# Altium schematic sheet 继电器板.SchDoc
size A2
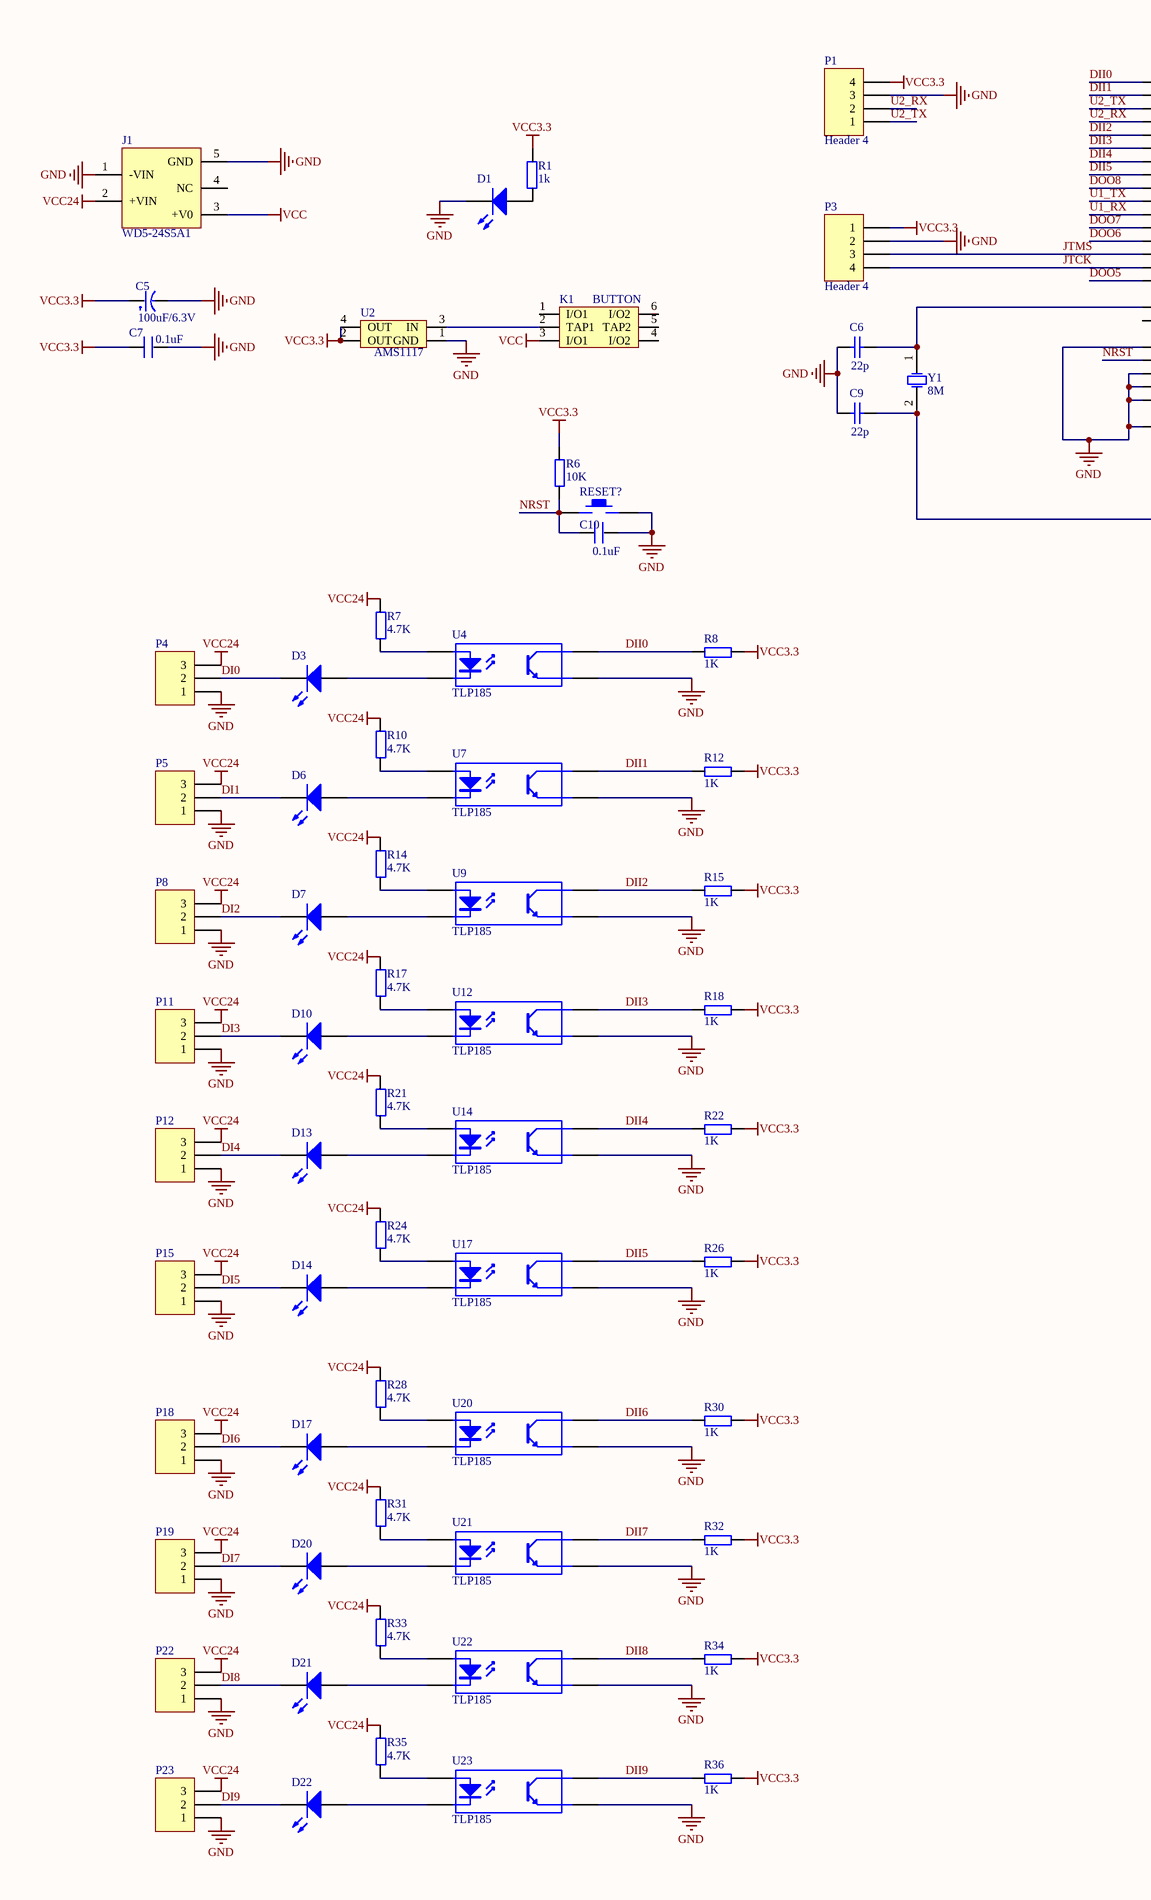
[diagram p0: 继电器板.SchDoc, left]
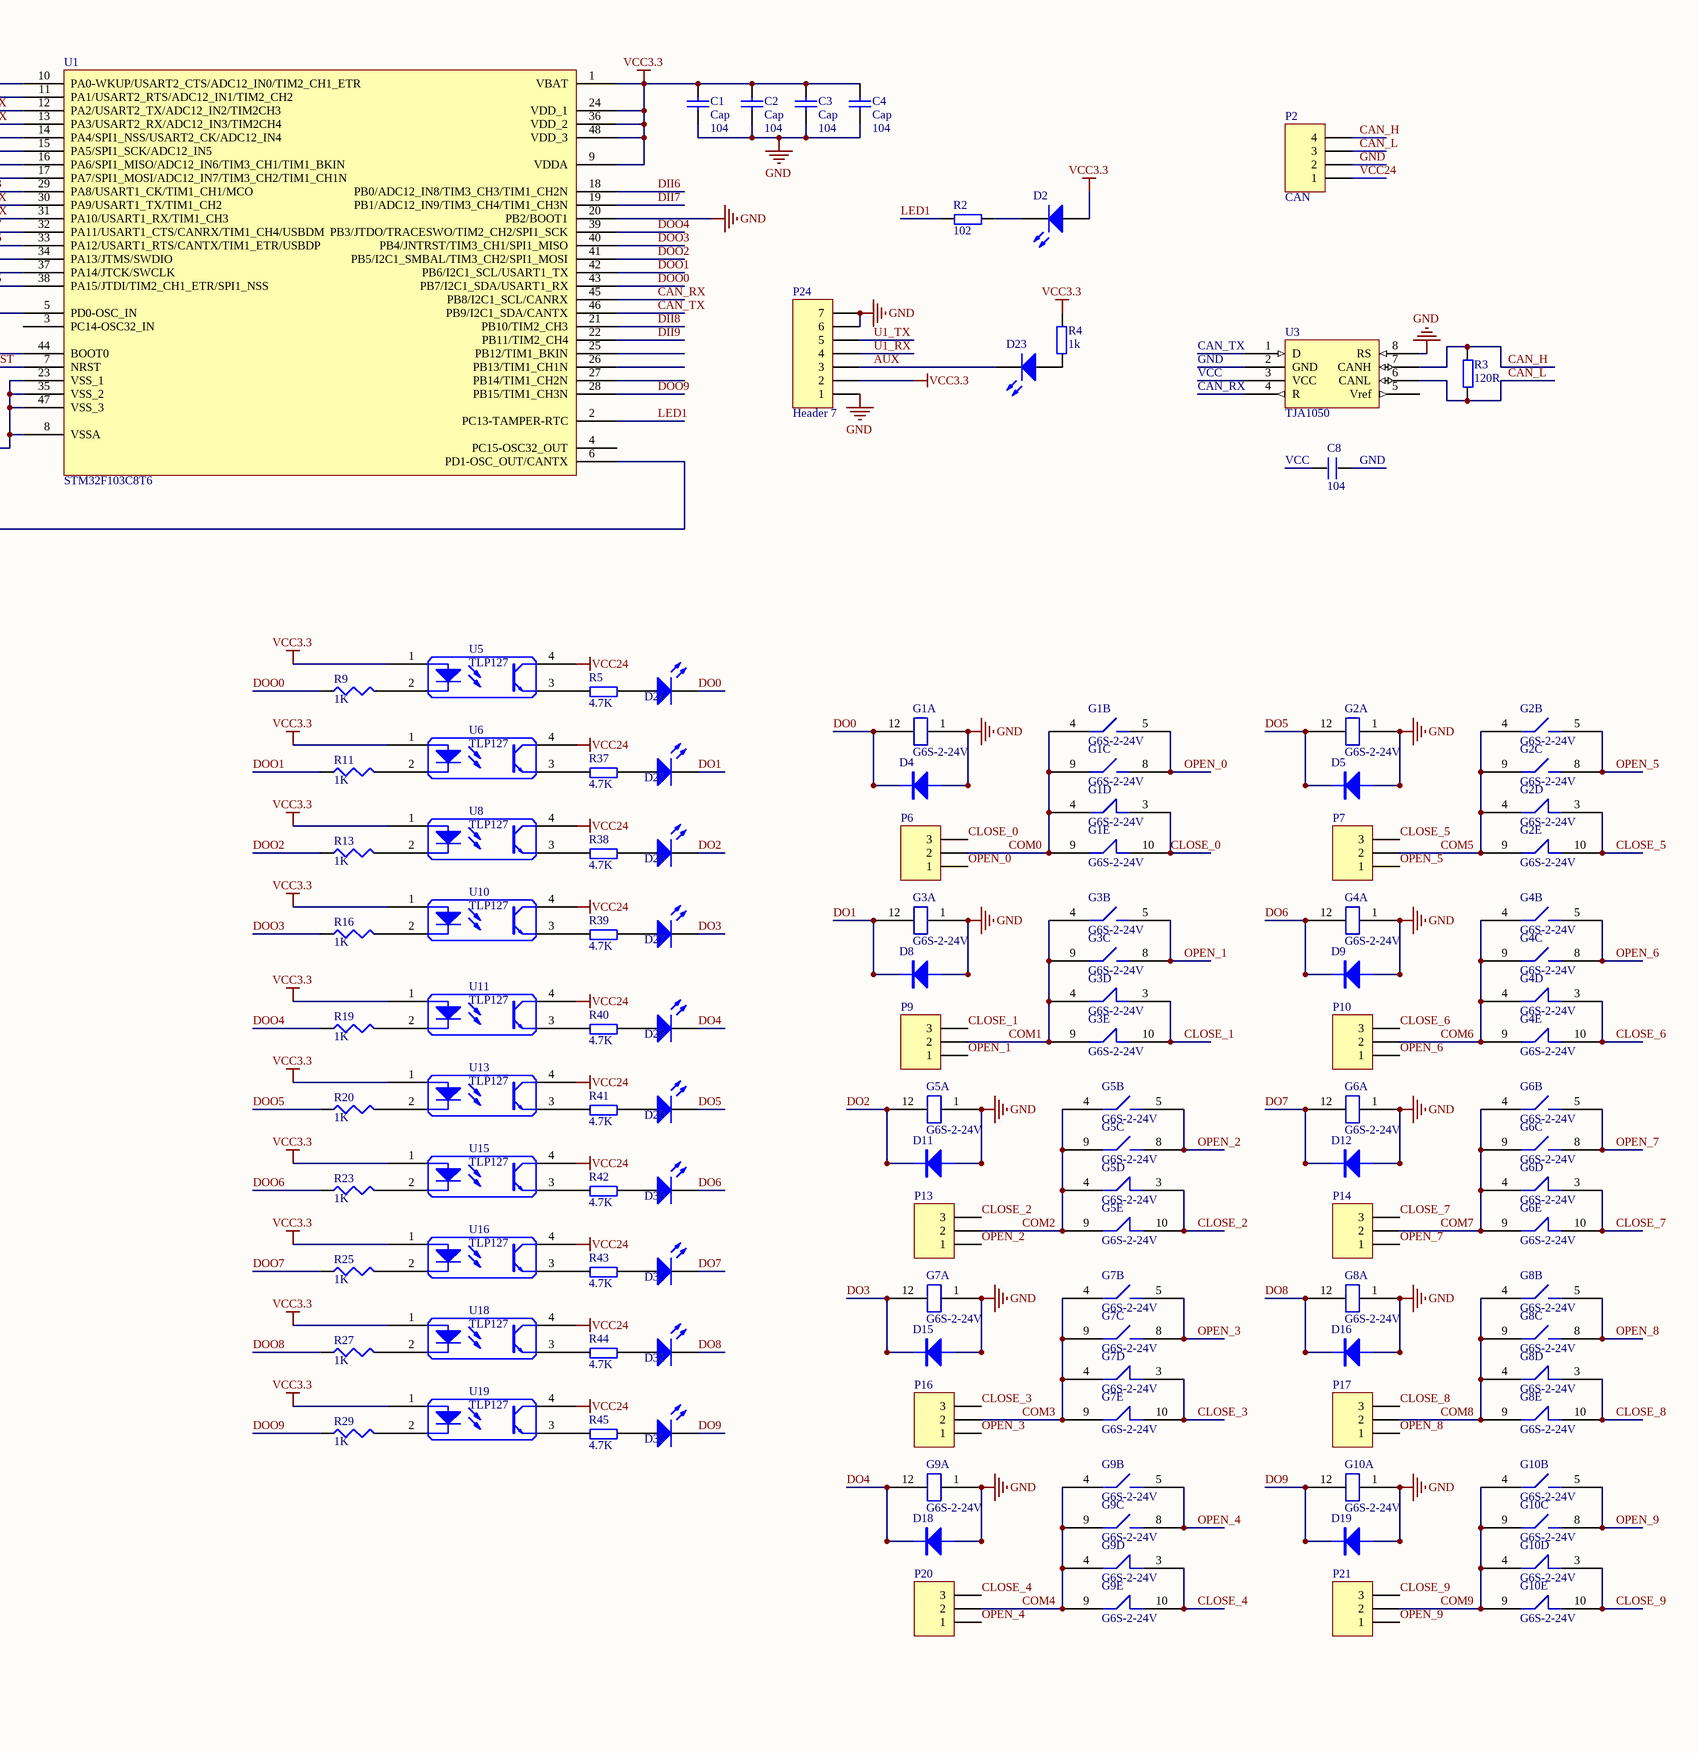
[diagram p1: 继电器板.SchDoc, right]

## Parts
C1  Cap  value 104  [C0805]
C2  Cap  value 104  [C0805]
C3  Cap  value 104  [C0805]
C4  Cap  value 104  [C0805]
C5  100uF/6.3V  [3216]
C6  value 22p  [C0805]  (hidden comment: Cap)
C7  0.1uF  [C0805]
C8  104  [C0805]
C9  value 22p  [C0805]  (hidden comment: Cap)
C10  0.1uF  [C0805]
D1  LED0  [LC-0805_LED_S1]  (value not drawn)
D2  LED0  [LC-0805_LED_S1]  (value not drawn)
D3  LED0  [LC-0805_LED_S1]  (value not drawn)
D4  (no value)  [LC-LL-34]
D5  (no value)  [LC-LL-34]
D6  LED0  [LC-0805_LED_S1]  (value not drawn)
D7  LED0  [LC-0805_LED_S1]  (value not drawn)
D8  (no value)  [LC-LL-34]
D9  (no value)  [LC-LL-34]
D10  LED0  [LC-0805_LED_S1]  (value not drawn)
D11  (no value)  [LC-LL-34]
D12  (no value)  [LC-LL-34]
D13  LED0  [LC-0805_LED_S1]  (value not drawn)
D14  LED0  [LC-0805_LED_S1]  (value not drawn)
D15  (no value)  [LC-LL-34]
D16  (no value)  [LC-LL-34]
D17  LED0  [LC-0805_LED_S1]  (value not drawn)
D18  (no value)  [LC-LL-34]
D19  (no value)  [LC-LL-34]
D20  LED0  [LC-0805_LED_S1]  (value not drawn)
D21  LED0  [LC-0805_LED_S1]  (value not drawn)
D22  LED0  [LC-0805_LED_S1]  (value not drawn)
D23  LED0  [LC-0805_LED_S1]  (value not drawn)
D24  LED0  [LC-0805_LED_S1]  (value not drawn)
D25  LED0  [LC-0805_LED_S1]  (value not drawn)
D26  LED0  [LC-0805_LED_S1]  (value not drawn)
D27  LED0  [LC-0805_LED_S1]  (value not drawn)
D28  LED0  [LC-0805_LED_S1]  (value not drawn)
D29  LED0  [LC-0805_LED_S1]  (value not drawn)
D30  LED0  [LC-0805_LED_S1]  (value not drawn)
D31  LED0  [LC-0805_LED_S1]  (value not drawn)
D32  LED0  [LC-0805_LED_S1]  (value not drawn)
D33  LED0  [LC-0805_LED_S1]  (value not drawn)
G1  G6S-2-24V  [G6S-2-24V]  (parts A,B,C,D,E of 5)
G2  G6S-2-24V  [G6S-2-24V]  (parts A,B,C,D,E of 5)
G3  G6S-2-24V  [G6S-2-24V]  (parts A,B,C,D,E of 5)
G4  G6S-2-24V  [G6S-2-24V]  (parts A,B,C,D,E of 5)
G5  G6S-2-24V  [G6S-2-24V]  (parts A,B,C,D,E of 5)
G6  G6S-2-24V  [G6S-2-24V]  (parts A,B,C,D,E of 5)
G7  G6S-2-24V  [G6S-2-24V]  (parts A,B,C,D,E of 5)
G8  G6S-2-24V  [G6S-2-24V]  (parts A,B,C,D,E of 5)
G9  G6S-2-24V  [G6S-2-24V]  (parts A,B,C,D,E of 5)
G10  G6S-2-24V  [G6S-2-24V]  (parts A,B,C,D,E of 5)
J1  WD5-24S5A1  [WD5-24S3V3]
K1  BUTTON  [BTN8.5*8.5]
P1  Header 4  [HDR1X4]
P2  CAN  [DZ-4-3.5]
P3  Header 4  [IDE4]
P4  (no value)  [DZ-3-3.5]
P5  (no value)  [DZ-3-3.5]
P6  (no value)  [DZ-3-3.5]
P7  (no value)  [DZ-3-3.5]
P8  (no value)  [DZ-3-3.5]
P9  (no value)  [DZ-3-3.5]
P10  (no value)  [DZ-3-3.5]
P11  (no value)  [DZ-3-3.5]
P12  (no value)  [DZ-3-3.5]
P13  (no value)  [DZ-3-3.5]
P14  (no value)  [DZ-3-3.5]
P15  (no value)  [DZ-3-3.5]
P16  (no value)  [DZ-3-3.5]
P17  (no value)  [DZ-3-3.5]
P18  (no value)  [DZ-3-3.5]
P19  (no value)  [DZ-3-3.5]
P20  (no value)  [DZ-3-3.5]
P21  (no value)  [DZ-3-3.5]
P22  (no value)  [DZ-3-3.5]
P23  (no value)  [DZ-3-3.5]
P24  Header 7  [AS50-T27]
R1  1k  [0805]
R2  102  [0805]
R3  120R  [0805]
R4  1k  [0805]
R5  4.7K  [0805]
R6  10K  [0805]
R7  4.7K  [0805]
R8  1K  [0805]
R9  1K  [0805]
R10  4.7K  [0805]
R11  1K  [0805]
R12  1K  [0805]
R13  1K  [0805]
R14  4.7K  [0805]
R15  1K  [0805]
R16  1K  [0805]
R17  4.7K  [0805]
R18  1K  [0805]
R19  1K  [0805]
R20  1K  [0805]
R21  4.7K  [0805]
R22  1K  [0805]
R23  1K  [0805]
R24  4.7K  [0805]
R25  1K  [0805]
R26  1K  [0805]
R27  1K  [0805]
R28  4.7K  [0805]
R29  1K  [0805]
R30  1K  [0805]
R31  4.7K  [0805]
R32  1K  [0805]
R33  4.7K  [0805]
R34  1K  [0805]
R35  4.7K  [0805]
R36  1K  [0805]
R37  4.7K  [0805]
R38  4.7K  [0805]
R39  4.7K  [0805]
R40  4.7K  [0805]
R41  4.7K  [0805]
R42  4.7K  [0805]
R43  4.7K  [0805]
R44  4.7K  [0805]
R45  4.7K  [0805]
RESET?  KEY_M  [SW_PB2_A1]  (value not drawn)
U1  STM32F103C8T6  [LC-LQFP-48]
U2  AMS1117  [LC-SOT-223]
U3  TJA1050  [SOP-8]
U4  TLP185  [TLP127]
U5  TLP127  [SO-4]
U6  TLP127  [SO-4]
U7  TLP185  [TLP127]
U8  TLP127  [SO-4]
U9  TLP185  [TLP127]
U10  TLP127  [SO-4]
U11  TLP127  [SO-4]
U12  TLP185  [TLP127]
U13  TLP127  [SO-4]
U14  TLP185  [TLP127]
U15  TLP127  [SO-4]
U16  TLP127  [SO-4]
U17  TLP185  [TLP127]
U18  TLP127  [SO-4]
U19  TLP127  [SO-4]
U20  TLP185  [TLP127]
U21  TLP185  [TLP127]
U22  TLP185  [TLP127]
U23  TLP185  [TLP127]
Y1  8M  [XTAL_US]

## Nets
GND: C1.2 C2.2 C3.2 C4.2 C5.2(GND) C6.2 C7.1 C8.2 C9.2 C10.2 D1.K D4.1(A) D5.1(A) D8.1(A) D9.1(A) D11.1(A) D12.1(A) D15.1(A) D16.1(A) D18.1(A) D19.1(A) G1.1 G2.1 G3.1 G4.1 G5.1 G6.1 G7.1 G8.1 G9.1 G10.1 J1.1(-VIN) J1.5(GND) P1.3 P2.2 P3.2 P4.1 P5.1 P8.1 P11.1 P12.1 P15.1 P18.1 P19.1 P22.1 P23.1 P24.1 P24.6 P24.7 RESET?.2 U1.8(VSSA) U1.20(PB2/BOOT1) U1.23(VSS_1) U1.35(VSS_2) U1.44(BOOT0) U1.47(VSS_3) U2.1(GND) U3.2(GND) U3.8(RS) U4.4(EMITTER) U7.4(EMITTER) U9.4(EMITTER) U12.4(EMITTER) U14.4(EMITTER) U17.4(EMITTER) U20.4(EMITTER) U21.4(EMITTER) U22.4(EMITTER) U23.4(EMITTER)
VCC: C8.1 J1.3(+V0) K1.3(I/O1) U3.3(VCC)
VCC3.3: C1.1 C2.1 C3.1 C4.1 C5.1(VCC) C7.2 D2.A P1.4 P3.1 P24.2 R1.1 R4.1 R6.2 R8.2 R12.2 R15.2 R18.2 R22.2 R26.2 R30.2 R32.2 R34.2 R36.2 U1.1(VBAT) U1.9(VDDA) U1.24(VDD_1) U1.36(VDD_2) U1.48(VDD_3) U2.2(OUT) U2.4(OUT) U5.1 U6.1 U8.1 U10.1 U11.1 U13.1 U15.1 U16.1 U18.1 U19.1
VCC24: J1.2(+VIN) P2.1 P4.3 P5.3 P8.3 P11.3 P12.3 P15.3 P18.3 P19.3 P22.3 P23.3 R7.2 R10.2 R14.2 R17.2 R21.2 R24.2 R28.2 R31.2 R33.2 R35.2 U5.4 U6.4 U8.4 U10.4 U11.4 U13.4 U15.4 U16.4 U18.4 U19.4
AUX: D23.K P24.3
CAN_H: P2.4 R3.2 U3.7(CANH)
CAN_L: P2.3 R3.1 U3.6(CANL)
CAN_RX: U1.45(PB8/I2C1_SCL/CANRX) U3.4(R)
CAN_TX: U1.46(PB9/I2C1_SDA/CANTX) U3.1(D)
CLOSE_0: G1.3 G1.10 P6.3
CLOSE_1: G3.3 G3.10 P9.3
CLOSE_2: G5.3 G5.10 P13.3
CLOSE_3: G7.3 G7.10 P16.3
CLOSE_4: G9.3 G9.10 P20.3
CLOSE_5: G2.3 G2.10 P7.3
CLOSE_6: G4.3 G4.10 P10.3
CLOSE_7: G6.3 G6.10 P14.3
CLOSE_8: G8.3 G8.10 P17.3
CLOSE_9: G10.3 G10.10 P21.3
COM0: G1.4 G1.9 P6.2
COM1: G3.4 G3.9 P9.2
COM2: G5.4 G5.9 P13.2
COM3: G7.4 G7.9 P16.2
COM4: G9.4 G9.9 P20.2
COM5: G2.4 G2.9 P7.2
COM6: G4.4 G4.9 P10.2
COM7: G6.4 G6.9 P14.2
COM8: G8.4 G8.9 P17.2
COM9: G10.4 G10.9 P21.2
DI0: D3.K P4.2
DI1: D6.K P5.2
DI2: D7.K P8.2
DI3: D10.K P11.2
DI4: D13.K P12.2
DI5: D14.K P15.2
DI6: D17.K P18.2
DI7: D20.K P19.2
DI8: D21.K P22.2
DI9: D22.K P23.2
DII0: R8.1 U1.10(PA0-WKUP/USART2_CTS/ADC12_IN0/TIM2_CH1_ETR) U4.6(COLLECTOR)
DII1: R12.1 U1.11(PA1/USART2_RTS/ADC12_IN1/TIM2_CH2) U7.6(COLLECTOR)
DII2: R15.1 U1.14(PA4/SPI1_NSS/USART2_CK/ADC12_IN4) U9.6(COLLECTOR)
DII3: R18.1 U1.15(PA5/SPI1_SCK/ADC12_IN5) U12.6(COLLECTOR)
DII4: R22.1 U1.16(PA6/SPI1_MISO/ADC12_IN6/TIM3_CH1/TIM1_BKIN) U14.6(COLLECTOR)
DII5: R26.1 U1.17(PA7/SPI1_MOSI/ADC12_IN7/TIM3_CH2/TIM1_CH1N) U17.6(COLLECTOR)
DII6: R30.1 U1.18(PB0/ADC12_IN8/TIM3_CH3/TIM1_CH2N) U20.6(COLLECTOR)
DII7: R32.1 U1.19(PB1/ADC12_IN9/TIM3_CH4/TIM1_CH3N) U21.6(COLLECTOR)
DII8: R34.1 U1.21(PB10/TIM2_CH3) U22.6(COLLECTOR)
DII9: R36.1 U1.22(PB11/TIM2_CH4) U23.6(COLLECTOR)
DO0: D4.2(K) D24.K G1.12
DO1: D8.2(K) D25.K G3.12
DO2: D11.2(K) D26.K G5.12
DO3: D15.2(K) D27.K G7.12
DO4: D18.2(K) D28.K G9.12
DO5: D5.2(K) D29.K G2.12
DO6: D9.2(K) D30.K G4.12
DO7: D12.2(K) D31.K G6.12
DO8: D16.2(K) D32.K G8.12
DO9: D19.2(K) D33.K G10.12
DOO0: R9.1 U1.43(PB7/I2C1_SDA/USART1_RX)
DOO1: R11.1 U1.42(PB6/I2C1_SCL/USART1_TX)
DOO2: R13.1 U1.41(PB5/I2C1_SMBAL/TIM3_CH2/SPI1_MOSI)
DOO3: R16.1 U1.40(PB4/JNTRST/TIM3_CH1/SPI1_MISO)
DOO4: R19.1 U1.39(PB3/JTDO/TRACESWO/TIM2_CH2/SPI1_SCK)
DOO5: R20.1 U1.38(PA15/JTDI/TIM2_CH1_ETR/SPI1_NSS)
DOO6: R23.1 U1.33(PA12/USART1_RTS/CANTX/TIM1_ETR/USBDP)
DOO7: R25.1 U1.32(PA11/USART1_CTS/CANRX/TIM1_CH4/USBDM)
DOO8: R27.1 U1.29(PA8/USART1_CK/TIM1_CH1/MCO)
DOO9: R29.1 U1.28(PB15/TIM1_CH3N)
JTCK: P3.4 U1.37(PA14/JTCK/SWCLK)
JTMS: P3.3 U1.34(PA13/JTMS/SWDIO)
LED1: R2.1 U1.2(PC13-TAMPER-RTC)
NRST: C10.1 R6.1 RESET?.1 U1.7(NRST)
OPEN_0: G1.5 G1.8 P6.1
OPEN_1: G3.5 G3.8 P9.1
OPEN_2: G5.5 G5.8 P13.1
OPEN_3: G7.5 G7.8 P16.1
OPEN_4: G9.5 G9.8 P20.1
OPEN_5: G2.5 G2.8 P7.1
OPEN_6: G4.5 G4.8 P10.1
OPEN_7: G6.5 G6.8 P14.1
OPEN_8: G8.5 G8.8 P17.1
OPEN_9: G10.5 G10.8 P21.1
U1_RX: P24.4 U1.31(PA10/USART1_RX/TIM1_CH3)
U1_TX: P24.5 U1.30(PA9/USART1_TX/TIM1_CH2)
U2_RX: P1.2 U1.13(PA3/USART2_RX/ADC12_IN3/TIM2CH4)
U2_TX: P1.1 U1.12(PA2/USART2_TX/ADC12_IN2/TIM2CH3)
NetC6_1: C6.1 U1.5(PD0-OSC_IN) Y1.1(OSC1)
NetC9_1: C9.1 U1.6(PD1-OSC_OUT/CANTX) Y1.2(OSC2)
NetD1_A: D1.A R1.2
NetD2_K: D2.K R2.2
NetD3_A: D3.A U4.3(CATHODE)
NetD6_A: D6.A U7.3(CATHODE)
NetD7_A: D7.A U9.3(CATHODE)
NetD10_A: D10.A U12.3(CATHODE)
NetD13_A: D13.A U14.3(CATHODE)
NetD14_A: D14.A U17.3(CATHODE)
NetD17_A: D17.A U20.3(CATHODE)
NetD20_A: D20.A U21.3(CATHODE)
NetD21_A: D21.A U22.3(CATHODE)
NetD22_A: D22.A U23.3(CATHODE)
NetD23_A: D23.A R4.2
NetD24_A: D24.A R5.2
NetD25_A: D25.A R37.2
NetD26_A: D26.A R38.2
NetD27_A: D27.A R39.2
NetD28_A: D28.A R40.2
NetD29_A: D29.A R41.2
NetD30_A: D30.A R42.2
NetD31_A: D31.A R43.2
NetD32_A: D32.A R44.2
NetD33_A: D33.A R45.2
NetK1_2: K1.2(TAP1) U2.3(IN)
NetR5_1: R5.1 U5.3
NetR7_1: R7.1 U4.1(ANODE)
NetR9_2: R9.2 U5.2
NetR10_1: R10.1 U7.1(ANODE)
NetR11_2: R11.2 U6.2
NetR13_2: R13.2 U8.2
NetR14_1: R14.1 U9.1(ANODE)
NetR16_2: R16.2 U10.2
NetR17_1: R17.1 U12.1(ANODE)
NetR19_2: R19.2 U11.2
NetR20_2: R20.2 U13.2
NetR21_1: R21.1 U14.1(ANODE)
NetR23_2: R23.2 U15.2
NetR24_1: R24.1 U17.1(ANODE)
NetR25_2: R25.2 U16.2
NetR27_2: R27.2 U18.2
NetR28_1: R28.1 U20.1(ANODE)
NetR29_2: R29.2 U19.2
NetR31_1: R31.1 U21.1(ANODE)
NetR33_1: R33.1 U22.1(ANODE)
NetR35_1: R35.1 U23.1(ANODE)
NetR37_1: R37.1 U6.3
NetR38_1: R38.1 U8.3
NetR39_1: R39.1 U10.3
NetR40_1: R40.1 U11.3
NetR41_1: R41.1 U13.3
NetR42_1: R42.1 U15.3
NetR43_1: R43.1 U16.3
NetR44_1: R44.1 U18.3
NetR45_1: R45.1 U19.3

Not connected (* = marked no-connect by the designer): J1 4(NC); K1 1(I/O1) 4(I/O2) 5(TAP2) 6(I/O2); U1 3(PC14-OSC32_IN) 4(PC15-OSC32_OUT) 25(PB12/TIM1_BKIN) 26(PB13/TIM1_CH1N) 27(PB14/TIM1_CH2N); U3 5(Vref)

## Library data of the parts
C1-C4 C6 C9 = Cap: Capacitor; Published: 8-Jun-2000; LatestRevisionDate: 17-Jul-2002; LatestRevisionNote: Re-released for DXP Platform.; PackageReference: RAD-0.3; Publisher: Altium Limited; PackageDescription: Radial Cap, Thru-Hole; 2 Leads; 0.3 in Pin Spacing
C5 = CAP
C7 C10 = C
C8 = C_3
D1-D3 D6 D7 D10 D13 D14 D17 D20-D33 = LED0: Typical INFRARED GaAs LED; Published: 8-Jun-2000; LatestRevisionDate: 08-Jul-2005; LatestRevisionNote: Mech Layer 1 removed.; PackageReference: LED-0; Publisher: Altium Limited; PackageDescription: LED; 2 Leads
D4 D5 D8 D9 D11 D12 D15 D16 D18 D19 = DIODE
G1-G10 = (no symbol name): G5SB-14-24VDC
J1 = WD5-24S3V3A1
P1-P3 = Header 4: Header, 4-Pin; LatestRevisionDate: 17-Jul-2002; LatestRevisionNote: Re-released for DXP Platform.; Publisher: Altium Limited
P4-P23 = Header 3: Header, 3-Pin; LatestRevisionDate: 17-Jul-2002; LatestRevisionNote: Re-released for DXP Platform.; Publisher: Altium Limited
P24 = Header 7: Header, 7-Pin; LatestRevisionDate: 17-Jul-2002; LatestRevisionNote: Re-released for DXP Platform.; Publisher: Altium Limited
R1-R8 R10 R12 R14 R15 R17 R18 R21 R22 R24 R26 R28 R30-R45 = R_2
R9 R11 R13 R16 R19 R20 R23 R25 R27 R29 = RES1
U1 = stm32f103v8t6
U3 = SN65HVD230D
U4 U7 U9 U12 U14 U17 U20-U23 = TLP127
U5 U6 U8 U10 U11 U13 U15 U16 U18 U19 = 2701
Y1 = XTAL: Crystal Oscillator; Published: 8-Jun-2000; LatestRevisionDate: 17-Jul-2002; LatestRevisionNote: Re-released for DXP Platform.; PackageReference: R38; Publisher: Altium Limited; PackageDescription: Crystal, Thru-Hole; 2 Leads; Body 3.1 x 8.2 mm (Dia.xH)